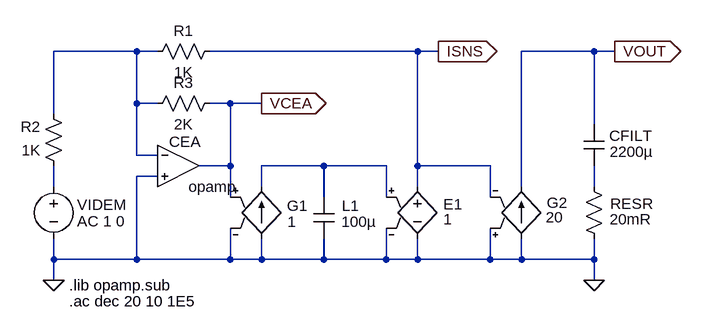
[diagram p0: schematic outfiltimodec.asc]
outfiltimodec.asc, the LTspice schematic file:
Version 4
SHEET 1 880 680
WIRE -944 224 -944 128
WIRE -944 336 -944 304
WIRE -944 448 -944 416
WIRE -944 480 -944 448
WIRE -816 128 -944 128
WIRE -816 208 -816 128
WIRE -816 288 -816 208
WIRE -816 448 -944 448
WIRE -816 448 -816 320
WIRE -784 128 -816 128
WIRE -784 208 -816 208
WIRE -784 288 -816 288
WIRE -784 320 -816 320
WIRE -672 208 -704 208
WIRE -672 304 -720 304
WIRE -672 304 -672 208
WIRE -672 352 -672 304
WIRE -672 448 -816 448
WIRE -672 448 -672 400
WIRE -624 208 -672 208
WIRE -624 336 -624 304
WIRE -624 448 -672 448
WIRE -624 448 -624 416
WIRE -528 304 -624 304
WIRE -528 352 -528 304
WIRE -528 448 -624 448
WIRE -528 448 -528 416
WIRE -432 304 -528 304
WIRE -432 352 -432 304
WIRE -432 448 -528 448
WIRE -432 448 -432 400
WIRE -384 128 -704 128
WIRE -384 304 -384 128
WIRE -384 336 -384 304
WIRE -384 448 -432 448
WIRE -384 448 -384 416
WIRE -352 128 -384 128
WIRE -272 304 -384 304
WIRE -272 352 -272 304
WIRE -272 448 -384 448
WIRE -272 448 -272 400
WIRE -224 336 -224 128
WIRE -224 448 -272 448
WIRE -224 448 -224 416
WIRE -112 128 -224 128
WIRE -112 240 -112 128
WIRE -112 336 -112 304
WIRE -112 448 -224 448
WIRE -112 448 -112 416
WIRE -112 480 -112 448
WIRE -80 128 -112 128
FLAG -80 128 VOUT
IOPIN -80 128 Out
FLAG -112 480 0
FLAG -944 480 0
FLAG -624 208 VCEA
IOPIN -624 208 Out
FLAG -352 128 ISNS
IOPIN -352 128 Out
SYMBOL cap -128 240 R0
WINDOW 0 39 18 Left 0
WINDOW 3 40 42 Left 0
SYMATTR InstName CFILT
SYMATTR Value 2200µ
SYMBOL res -128 320 R0
WINDOW 0 41 42 Left 0
WINDOW 3 40 66 Left 0
SYMATTR InstName RESR
SYMATTR Value 20mR
SYMBOL cap -544 352 R0
WINDOW 0 44 13 Left 0
WINDOW 3 43 38 Left 0
SYMATTR InstName L1
SYMATTR Value 100µ
SYMBOL g -624 320 R0
WINDOW 0 39 45 Left 0
WINDOW 3 40 70 Left 0
SYMATTR InstName G1
SYMATTR Value 1
SYMBOL Opamps\\opamp -752 240 R0
WINDOW 0 -14 27 Left 0
SYMATTR InstName CEA
SYMATTR SpiceLine2 GBW=2Meg
SYMBOL res -688 112 R90
WINDOW 0 0 56 VBottom 0
WINDOW 3 32 56 VTop 0
SYMATTR InstName R1
SYMATTR Value 1K
SYMBOL res -928 320 R180
WINDOW 0 36 76 Left 0
WINDOW 3 36 40 Left 0
SYMATTR InstName R2
SYMATTR Value 1K
SYMBOL res -800 224 R270
WINDOW 0 32 56 VTop 0
WINDOW 3 0 56 VBottom 0
SYMATTR InstName R3
SYMATTR Value 2K
SYMBOL voltage -944 320 R0
WINDOW 0 36 44 Left 0
WINDOW 3 37 68 Left 0
WINDOW 123 36 69 Left 0
WINDOW 39 0 0 Left 0
SYMATTR InstName VIDEM
SYMATTR Value ""
SYMATTR Value2 AC 1 0
SYMBOL e -384 320 R0
WINDOW 0 40 43 Left 0
WINDOW 3 40 66 Left 0
SYMATTR InstName E1
SYMATTR Value 1
SYMBOL g2 -224 320 R0
WINDOW 0 39 41 Left 0
WINDOW 3 38 63 Left 0
SYMATTR InstName G2
SYMATTR Value 20
TEXT -920 488 Left 0 !.lib opamp.sub
TEXT -920 512 Left 0 !.ac dec 20 10 1E5

The netlist it stands for:
* outfiltimodec.asc
CFILT VOUT N004 2200µ
RESR N004 0 20mR
C§L1 N003 0 100µ
G1 0 N003 VCEA 0 1
XCEA N001 0 VCEA opamp Aol=100K GBW=2Meg  ; pins invin noninvin out
R1 ISNS N001 1K
R2 N002 N001 1K
R3 N001 VCEA 2K
VIDEM N002 0 AC 1 0
E1 ISNS 0 N003 0 1
G2 0 VOUT 0 ISNS 20
.lib opamp.sub
.ac dec 20 10 1E5
.backanno
.end